# EAGLE schematic Clock (EAGLE 8.3.2)
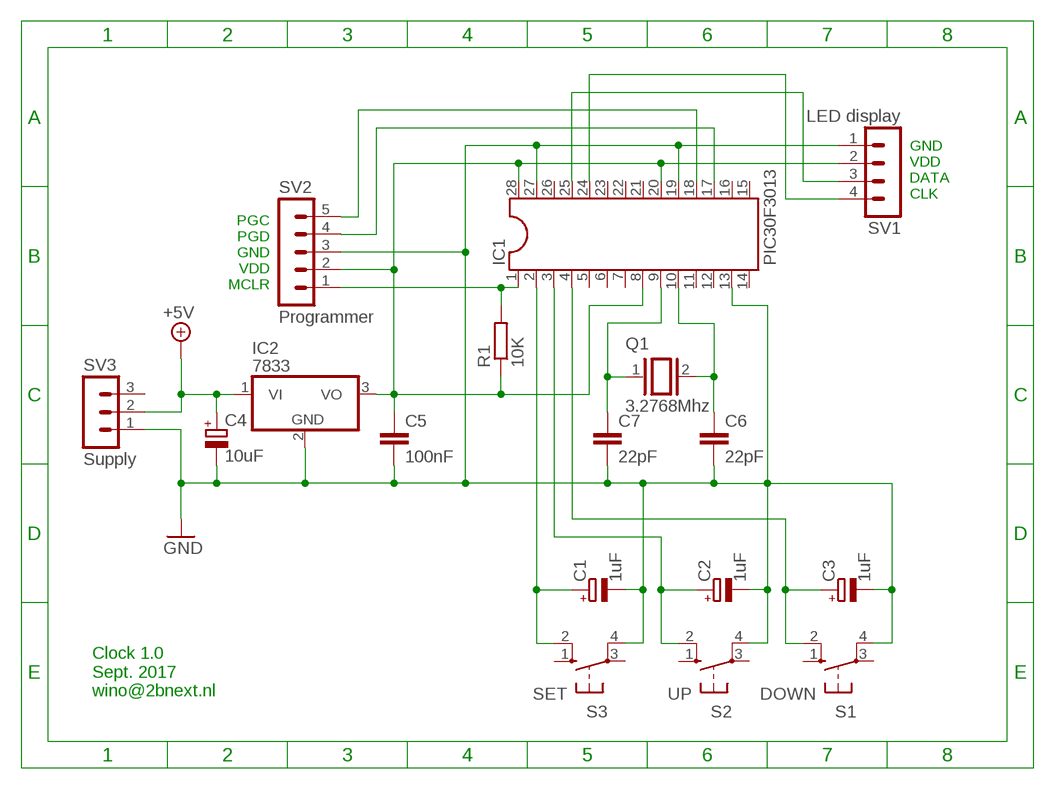
[diagram p0: schematic, sheet 1]

## Parts
C1  1uF  CPOL-EUE2.5-5  [E2,5-5]
C2  1uF  CPOL-EUE2.5-5  [E2,5-5]
C3  1uF  CPOL-EUE2.5-5  [E2,5-5]
C4  10uF  CPOL-EUE2.5-5  [E2,5-5]
C5  100nF  C2,5-3  [C2.5-3]
C6  22pF  C2,5-3  [C2.5-3]
C7  22pF  C2,5-3  [C2.5-3]
IC1  PIC30F3013  DIL28-3  [DIL28-3]
IC2  7833  7805T  [TO220H]
Q1  3.2768Mhz  XTAL/S  [QS]
R1  10K  R-EU_0207/7  [0207/7]
S1  DOWN  10-XX  [B3F-10XX]
S2  UP  10-XX  [B3F-10XX]
S3  SET  10-XX  [B3F-10XX]
SV1  LED display  MA04-1  [MA04-1]
SV2  Programmer  MA05-1  [MA05-1]
SV3  Supply  MA03-1  [MA03-1]

## Nets
+5V: C4.+ IC2.1(VI) SV3.2
GND: C1.- C2.- C3.- C4.- C5.2 C6.2 C7.2 IC1.13 IC1.19 IC1.27 IC2.2(GND) S1.4(P1) S2.4(P1) S3.4(P1) SV1.1 SV2.3 SV3.1
N$1: C7.1 IC1.9 Q1.1
N$2: C6.1 IC1.10 Q1.2
N$3: C1.+ IC1.2 S3.2(S1)
N$4: C5.1 IC1.8 IC1.20 IC1.28 IC2.3(VO) R1.1 SV1.2 SV2.2
N$5: IC1.1 R1.2 SV2.1
N$6: C2.+ IC1.3 S2.2(S1)
N$7: C3.+ IC1.4 S1.2(S1)
N$8: IC1.25 SV1.3
N$9: IC1.24 SV1.4
N$10: IC1.17 SV2.4
N$11: IC1.18 SV2.5
Unconnected: IC1.5 IC1.6 IC1.7 IC1.11 IC1.12 IC1.14 IC1.15 IC1.16 IC1.21 IC1.22 IC1.23 IC1.26 S1.1(S) S1.3(P) S2.1(S) S2.3(P) S3.1(S) S3.3(P) SV3.3

## Notes on the sheet
- GND
  VDD
  DATA
  CLK
- PGC
  PGD
  GND
  VDD
  MCLR
- Clock 1.0
  Sept. 2017
  wino@2bnext.nl

## Library data of the parts
C1-C4 = rcl:CPOL-EU: POLARIZED CAPACITOR, European symbol
C5-C7 = capacitor-wima:C: CAPACITOR naming: grid - package width
IC1 = ic-package:DIL28: Dual In Line
IC2 = linear:78*: Positive VOLTAGE REGULATOR Source: http://cache.national.com/ds/LM/LM78L05.pdf http://www.fairchildsemi.com/ds/LM/LM7805.pdf
Q1 = special:XTAL/S: CRYSTAL
R1 = rcl:R-EU_: RESISTOR, European symbol
S1-S3 = switch-omron:10-XX: OMRON SWITCH; MPN: B3F-1000; OC_FARNELL: 176432; OC_NEWARK: 36M3542
SV1 = con-lstb:MA04-1: PIN HEADER; OC_FARNELL: unknown; OC_NEWARK: unknown
SV2 = con-lstb:MA05-1: PIN HEADER; OC_FARNELL: unknown; OC_NEWARK: unknown
SV3 = con-lstb:MA03-1: PIN HEADER; OC_FARNELL: unknown; OC_NEWARK: unknown